# Altium schematic sheet Screen.SchDoc
size A
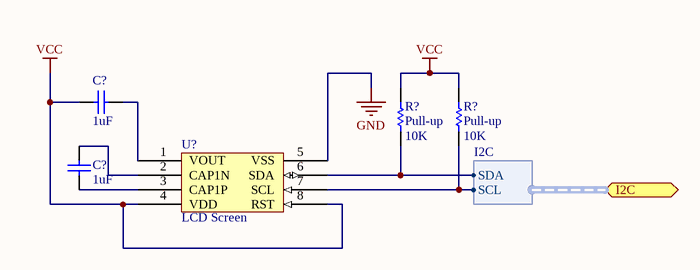
[diagram p0: Screen.SchDoc]

## Parts
(Parts that share a designator on the sheet are numbered #1, #2 ... from top to bottom, then left to right.)
C?#1  1uF  [RAD-0.3]
C?#2  1uF  [RAD-0.3]
R?#1  Pull-up  value 10K  [AXIAL-0.3]
R?#2  Pull-up  value 10K  [AXIAL-0.3]
U?  LCD Screen

## Ports
I2C (harness I2C)

## Harnesses
I2C: SCL, SDA

## Nets
GND: U?.5(VSS)
VCC: C?#1.2 R?#1.2 R?#2.2 U?.4(VDD) U?.8(RST)
NetC?#1_1: C?#1.1 U?.1(VOUT)
NetC?#2_1: C?#2.1 U?.3(CAP1P)
NetC?#2_2: C?#2.2 U?.2(CAP1N)
NetR?#1_1: R?#1.1 U?.6(SDA) ; port I2C.SDA
NetR?#2_1: R?#2.1 U?.7(SCL) ; port I2C.SCL

## Library data of the parts
C?#1 C?#2 = Cap: Capacitor; Published: 8-Jun-2000; LatestRevisionDate: 17-Jul-2002; LatestRevisionNote: Re-released for DXP Platform.; PackageReference: RAD-0.3; Publisher: Altium Limited; PackageDescription: Radial Cap, Thru-Hole; 2 Leads; 0.3 in Pin Spacing; Value: 1uF
R?#1 R?#2 = Res1: Resistor; Published: 8-Jun-2000; LatestRevisionDate: 17-Jul-2002; LatestRevisionNote: Re-released for DXP Platform.; PackageReference: AXIAL-0.3; Publisher: Altium Limited; PackageDescription: Axial Device, Thru-Hole; 2 Leads; 0.3 in Pin Spacing
U? = MCCOG22005A6W-BNMLWI: Producer: Midas; CommandePrototype: Yes; Supplier: Farnell; SupplierRef: 2218944; ProducerRef: MCCOG22005A6W-BNMLWI